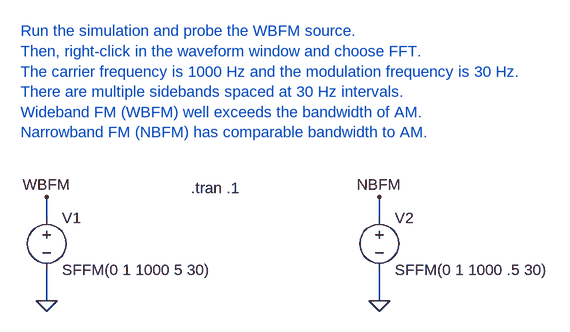
[diagram p0: schematic fm.asc]
fm.asc, the LTspice schematic file:
Version 4
SHEET 1 928 680
WIRE -272 208 -272 176
WIRE 240 208 240 176
WIRE -272 336 -272 288
WIRE 240 336 240 288
FLAG -272 336 0
FLAG -272 176 WBFM
FLAG 240 336 0
FLAG 240 176 NBFM
SYMBOL voltage -272 192 R0
WINDOW 123 0 0 Left 0
WINDOW 39 0 0 Left 0
SYMATTR InstName V1
SYMATTR Value SFFM(0 1 1000 5 30)
SYMBOL voltage 240 192 R0
WINDOW 123 0 0 Left 0
WINDOW 39 0 0 Left 0
SYMATTR InstName V2
SYMATTR Value SFFM(0 1 1000 .5 30)
TEXT -50 162 Left 0 !.tran .1
TEXT -312 -80 Left 0 ;Run the simulation and probe the WBFM source.\nThen, right-click in the waveform window and choose FFT.\nThe carrier frequency is 1000 Hz and the modulation frequency is 30 Hz.\nThere are multiple sidebands spaced at 30 Hz intervals.\nWideband FM (WBFM) well exceeds the bandwidth of AM.\nNarrowband FM (NBFM) has comparable bandwidth to AM.

The netlist it stands for:
* fm.asc
V1 WBFM 0 SFFM(0 1 1000 5 30)
V2 NBFM 0 SFFM(0 1 1000 .5 30)
.tran .1
* Run the simulation and probe the WBFM source.
* Then, right-click in the waveform window and choose FFT.
* The carrier frequency is 1000 Hz and the modulation frequency is 30 Hz.
* There are multiple sidebands spaced at 30 Hz intervals.
* Wideband FM (WBFM) well exceeds the bandwidth of AM.
* Narrowband FM (NBFM) has comparable bandwidth to AM.
.backanno
.end